# Altium project Flex_PCB.PrjPcb
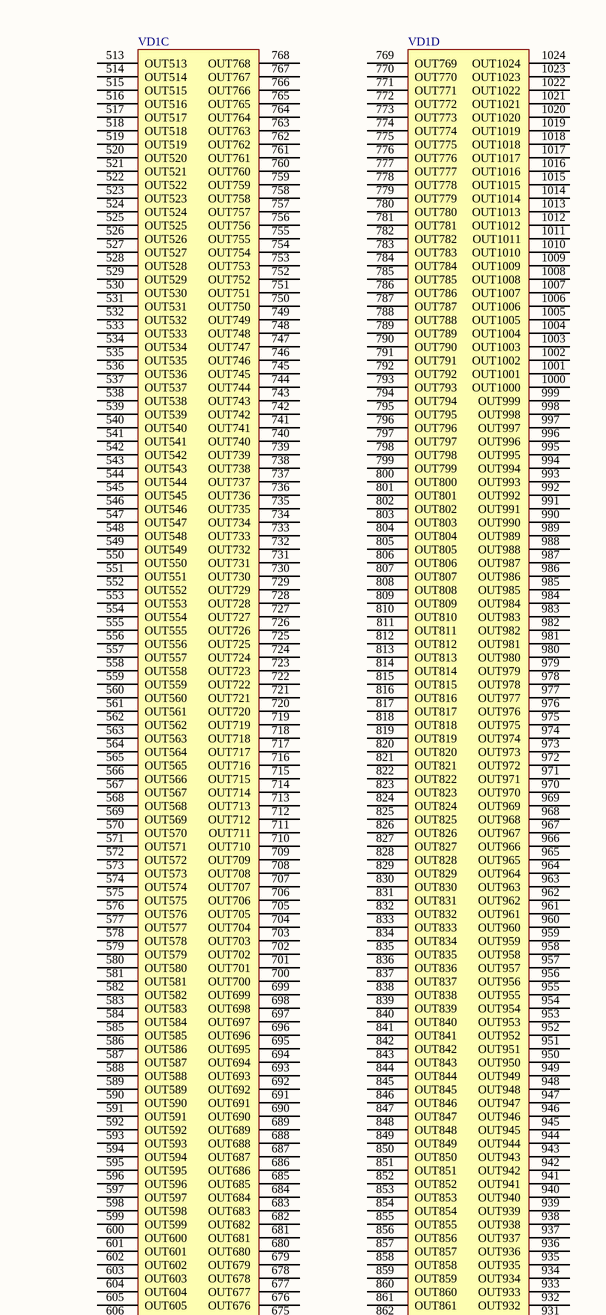
[diagram p0: Sheet1.SchDoc, top right]
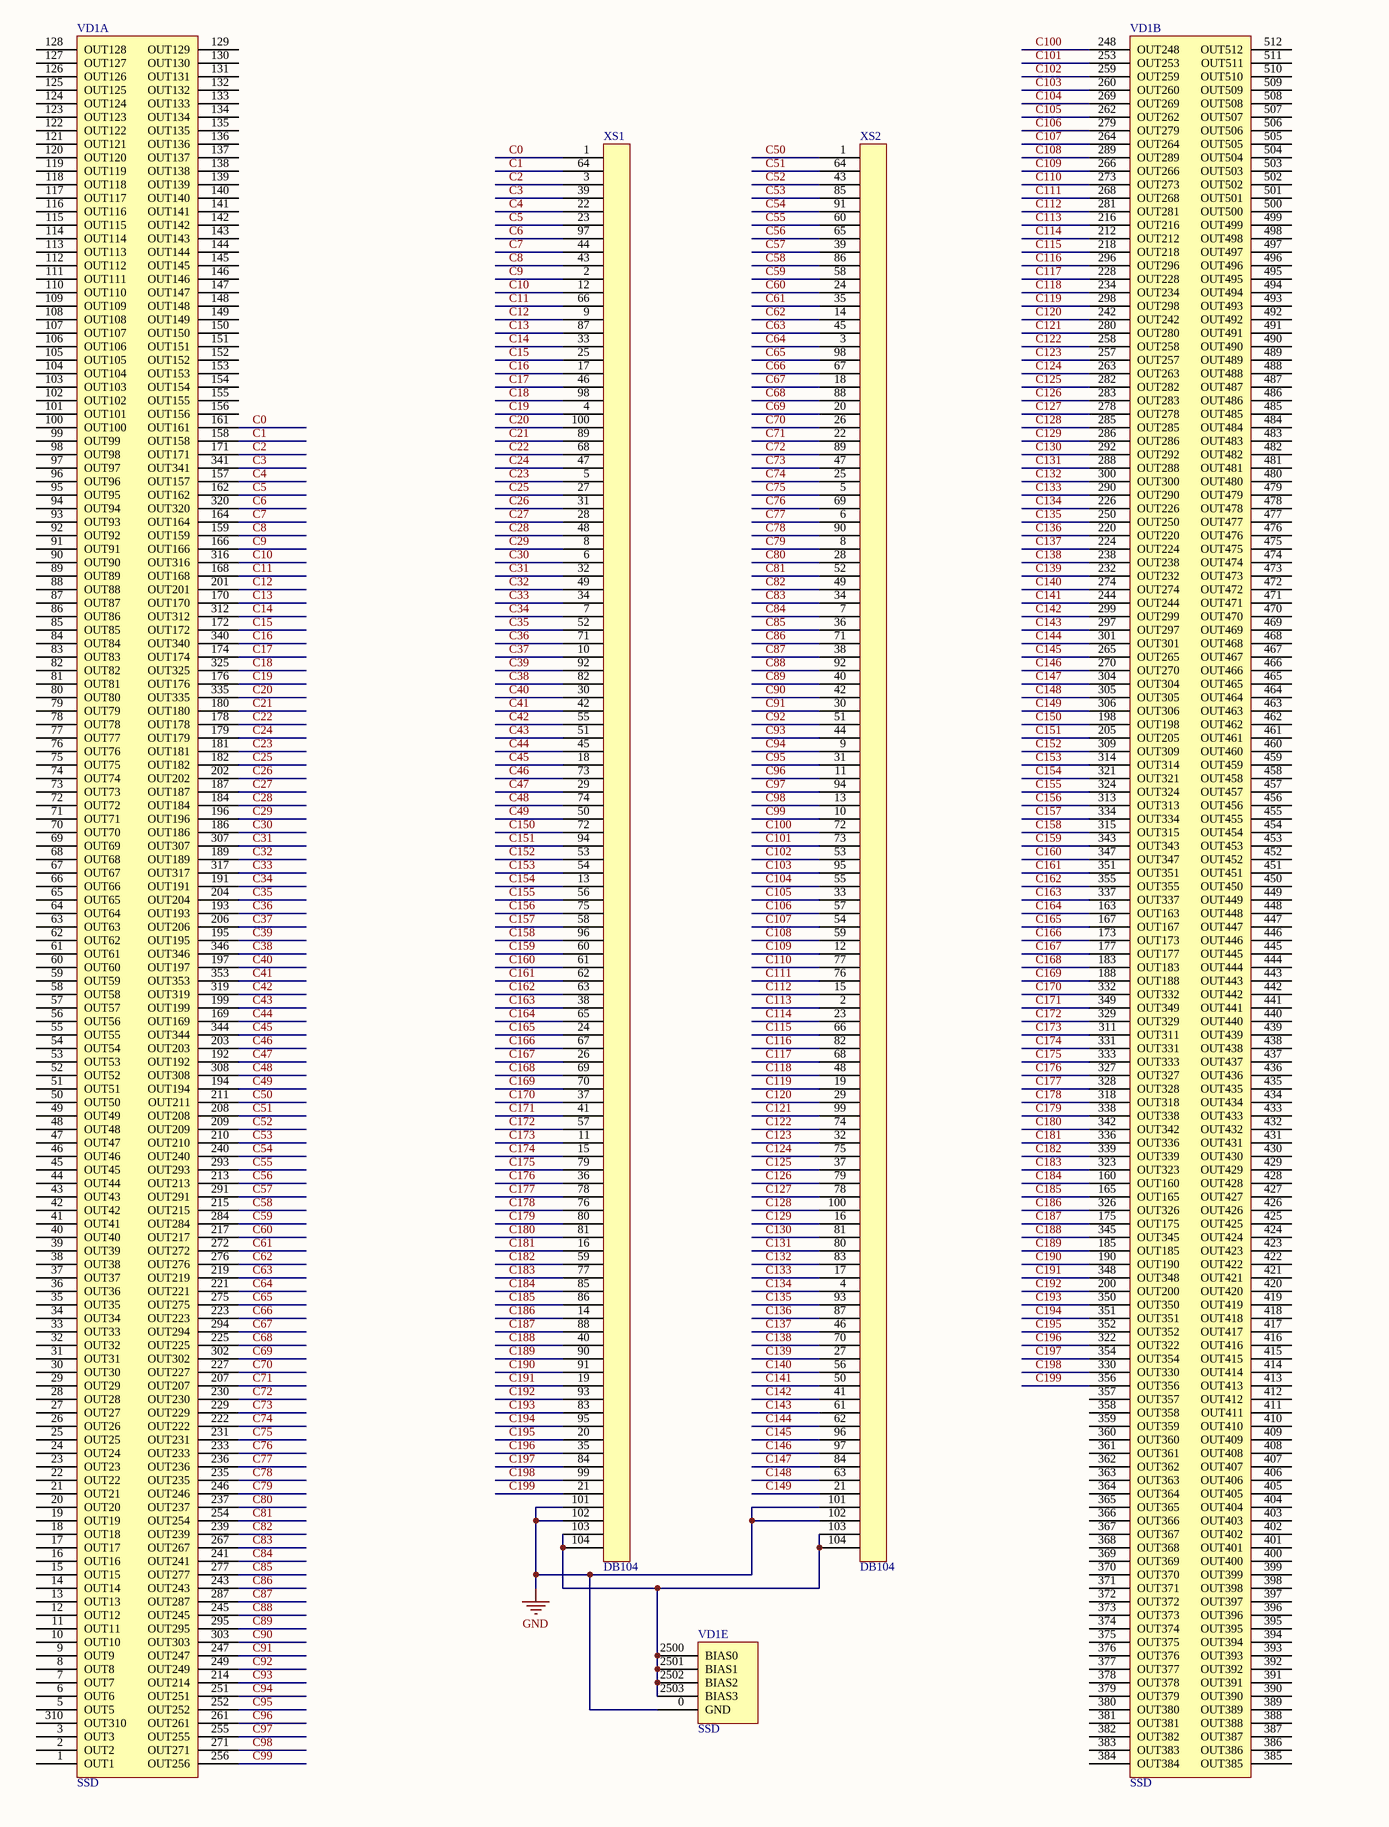
[diagram p1: Sheet1.SchDoc, bottom left]
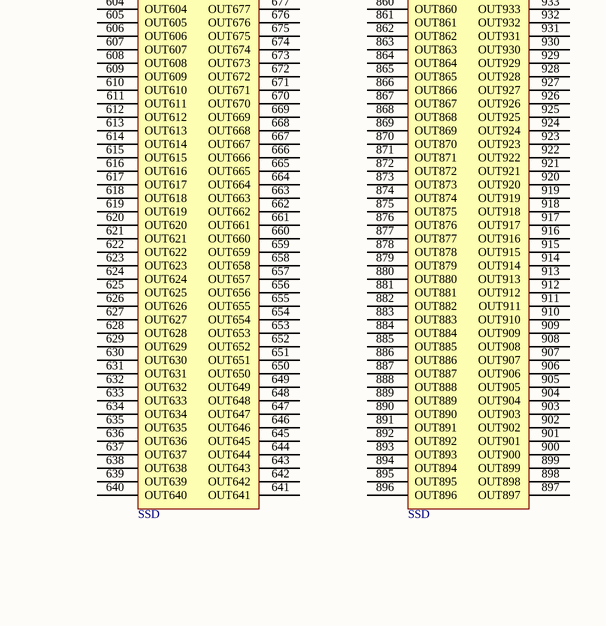
[diagram p2: Sheet1.SchDoc, bottom right]
1 sheet, 3 parts. Net scope: global (net labels, ports and power ports of the same name join across sheets).
Board file: PCB.PcbDoc

## Sheet Sheet1.SchDoc
size A1

### Parts
VD1  SSD  [QFN20P11000X11000X80-2048N]  (parts A,B,C,D,E of 5)
XS1  DB104  [DB104]
XS2  DB104  [DB104]

### Nets
GND: VD1.0(GND) XS1.101 XS1.102 XS2.101 XS2.102
C0: VD1.161(OUT161) XS1.1
C1: VD1.158(OUT158) XS1.64
C2: VD1.171(OUT171) XS1.3
C3: VD1.341(OUT341) XS1.39
C4: VD1.157(OUT157) XS1.22
C5: VD1.162(OUT162) XS1.23
C6: VD1.320(OUT320) XS1.97
C7: VD1.164(OUT164) XS1.44
C8: VD1.159(OUT159) XS1.43
C9: VD1.166(OUT166) XS1.2
C10: VD1.316(OUT316) XS1.12
C11: VD1.168(OUT168) XS1.66
C12: VD1.201(OUT201) XS1.9
C13: VD1.170(OUT170) XS1.87
C14: VD1.312(OUT312) XS1.33
C15: VD1.172(OUT172) XS1.25
C16: VD1.340(OUT340) XS1.17
C17: VD1.174(OUT174) XS1.46
C18: VD1.325(OUT325) XS1.98
C19: VD1.176(OUT176) XS1.4
C20: VD1.335(OUT335) XS1.100
C21: VD1.180(OUT180) XS1.89
C22: VD1.178(OUT178) XS1.68
C23: VD1.181(OUT181) XS1.5
C24: VD1.179(OUT179) XS1.47
C25: VD1.182(OUT182) XS1.27
C26: VD1.202(OUT202) XS1.31
C27: VD1.187(OUT187) XS1.28
C28: VD1.184(OUT184) XS1.48
C29: VD1.196(OUT196) XS1.8
C30: VD1.186(OUT186) XS1.6
C31: VD1.307(OUT307) XS1.32
C32: VD1.189(OUT189) XS1.49
C33: VD1.317(OUT317) XS1.34
C34: VD1.191(OUT191) XS1.7
C35: VD1.204(OUT204) XS1.52
C36: VD1.193(OUT193) XS1.71
C37: VD1.206(OUT206) XS1.10
C38: VD1.346(OUT346) XS1.82
C39: VD1.195(OUT195) XS1.92
C40: VD1.197(OUT197) XS1.30
C41: VD1.353(OUT353) XS1.42
C42: VD1.319(OUT319) XS1.55
C43: VD1.199(OUT199) XS1.51
C44: VD1.169(OUT169) XS1.45
C45: VD1.344(OUT344) XS1.18
C46: VD1.203(OUT203) XS1.73
C47: VD1.192(OUT192) XS1.29
C48: VD1.308(OUT308) XS1.74
C49: VD1.194(OUT194) XS1.50
C50: VD1.211(OUT211) XS2.1
C51: VD1.208(OUT208) XS2.64
C52: VD1.209(OUT209) XS2.43
C53: VD1.210(OUT210) XS2.85
C54: VD1.240(OUT240) XS2.91
C55: VD1.293(OUT293) XS2.60
C56: VD1.213(OUT213) XS2.65
C57: VD1.291(OUT291) XS2.39
C58: VD1.215(OUT215) XS2.86
C59: VD1.284(OUT284) XS2.58
C60: VD1.217(OUT217) XS2.24
C61: VD1.272(OUT272) XS2.35
C62: VD1.276(OUT276) XS2.14
C63: VD1.219(OUT219) XS2.45
C64: VD1.221(OUT221) XS2.3
C65: VD1.275(OUT275) XS2.98
C66: VD1.223(OUT223) XS2.67
C67: VD1.294(OUT294) XS2.18
C68: VD1.225(OUT225) XS2.88
C69: VD1.302(OUT302) XS2.20
C70: VD1.227(OUT227) XS2.26
C71: VD1.207(OUT207) XS2.22
C72: VD1.230(OUT230) XS2.89
C73: VD1.229(OUT229) XS2.47
C74: VD1.222(OUT222) XS2.25
C75: VD1.231(OUT231) XS2.5
C76: VD1.233(OUT233) XS2.69
C77: VD1.236(OUT236) XS2.6
C78: VD1.235(OUT235) XS2.90
C79: VD1.246(OUT246) XS2.8
C80: VD1.237(OUT237) XS2.28
C81: VD1.254(OUT254) XS2.52
C82: VD1.239(OUT239) XS2.49
C83: VD1.267(OUT267) XS2.34
C84: VD1.241(OUT241) XS2.7
C85: VD1.277(OUT277) XS2.36
C86: VD1.243(OUT243) XS2.71
C87: VD1.287(OUT287) XS2.38
C88: VD1.245(OUT245) XS2.92
C89: VD1.295(OUT295) XS2.40
C90: VD1.303(OUT303) XS2.42
C91: VD1.247(OUT247) XS2.30
C92: VD1.249(OUT249) XS2.51
C93: VD1.214(OUT214) XS2.44
C94: VD1.251(OUT251) XS2.9
C95: VD1.252(OUT252) XS2.31
C96: VD1.261(OUT261) XS2.11
C97: VD1.255(OUT255) XS2.94
C98: VD1.271(OUT271) XS2.13
C99: VD1.256(OUT256) XS2.10
C100: VD1.248(OUT248) XS2.72
C101: VD1.253(OUT253) XS2.73
C102: VD1.259(OUT259) XS2.53
C103: VD1.260(OUT260) XS2.95
C104: VD1.269(OUT269) XS2.55
C105: VD1.262(OUT262) XS2.33
C106: VD1.279(OUT279) XS2.57
C107: VD1.264(OUT264) XS2.54
C108: VD1.289(OUT289) XS2.59
C109: VD1.266(OUT266) XS2.12
C110: VD1.273(OUT273) XS2.77
C111: VD1.268(OUT268) XS2.76
C112: VD1.281(OUT281) XS2.15
C113: VD1.216(OUT216) XS2.2
C114: VD1.212(OUT212) XS2.23
C115: VD1.218(OUT218) XS2.66
C116: VD1.296(OUT296) XS2.82
C117: VD1.228(OUT228) XS2.68
C118: VD1.234(OUT234) XS2.48
C119: VD1.298(OUT298) XS2.19
C120: VD1.242(OUT242) XS2.29
C121: VD1.280(OUT280) XS2.99
C122: VD1.258(OUT258) XS2.74
C123: VD1.257(OUT257) XS2.32
C124: VD1.263(OUT263) XS2.75
C125: VD1.282(OUT282) XS2.37
C126: VD1.283(OUT283) XS2.79
C127: VD1.278(OUT278) XS2.78
C128: VD1.285(OUT285) XS2.100
C129: VD1.286(OUT286) XS2.16
C130: VD1.292(OUT292) XS2.81
C131: VD1.288(OUT288) XS2.80
C132: VD1.300(OUT300) XS2.83
C133: VD1.290(OUT290) XS2.17
C134: VD1.226(OUT226) XS2.4
C135: VD1.250(OUT250) XS2.93
C136: VD1.220(OUT220) XS2.87
C137: VD1.224(OUT224) XS2.46
C138: VD1.238(OUT238) XS2.70
C139: VD1.232(OUT232) XS2.27
C140: VD1.274(OUT274) XS2.56
C141: VD1.244(OUT244) XS2.50
C142: VD1.299(OUT299) XS2.41
C143: VD1.297(OUT297) XS2.61
C144: VD1.301(OUT301) XS2.62
C145: VD1.265(OUT265) XS2.96
C146: VD1.270(OUT270) XS2.97
C147: VD1.304(OUT304) XS2.84
C148: VD1.305(OUT305) XS2.63
C149: VD1.306(OUT306) XS2.21
C150: VD1.198(OUT198) XS1.72
C151: VD1.205(OUT205) XS1.94
C152: VD1.309(OUT309) XS1.53
C153: VD1.314(OUT314) XS1.54
C154: VD1.321(OUT321) XS1.13
C155: VD1.324(OUT324) XS1.56
C156: VD1.313(OUT313) XS1.75
C157: VD1.334(OUT334) XS1.58
C158: VD1.315(OUT315) XS1.96
C159: VD1.343(OUT343) XS1.60
C160: VD1.347(OUT347) XS1.61
C161: VD1.351(OUT351) XS1.62
C162: VD1.355(OUT355) XS1.63
C163: VD1.337(OUT337) XS1.38
C164: VD1.163(OUT163) XS1.65
C165: VD1.167(OUT167) XS1.24
C166: VD1.173(OUT173) XS1.67
C167: VD1.177(OUT177) XS1.26
C168: VD1.183(OUT183) XS1.69
C169: VD1.188(OUT188) XS1.70
C170: VD1.332(OUT332) XS1.37
C171: VD1.349(OUT349) XS1.41
C172: VD1.329(OUT329) XS1.57
C173: VD1.311(OUT311) XS1.11
C174: VD1.331(OUT331) XS1.15
C175: VD1.333(OUT333) XS1.79
C176: VD1.327(OUT327) XS1.36
C177: VD1.328(OUT328) XS1.78
C178: VD1.318(OUT318) XS1.76
C179: VD1.338(OUT338) XS1.80
C180: VD1.342(OUT342) XS1.81
C181: VD1.336(OUT336) XS1.16
C182: VD1.339(OUT339) XS1.59
C183: VD1.323(OUT323) XS1.77
C184: VD1.160(OUT160) XS1.85
C185: VD1.165(OUT165) XS1.86
C186: VD1.326(OUT326) XS1.14
C187: VD1.175(OUT175) XS1.88
C188: VD1.345(OUT345) XS1.40
C189: VD1.185(OUT185) XS1.90
C190: VD1.190(OUT190) XS1.91
C191: VD1.348(OUT348) XS1.19
C192: VD1.200(OUT200) XS1.93
C193: VD1.350(OUT350) XS1.83
C194: VD1.351(OUT351) XS1.95
C195: VD1.352(OUT352) XS1.20
C196: VD1.322(OUT322) XS1.35
C197: VD1.354(OUT354) XS1.84
C198: VD1.330(OUT330) XS1.99
C199: VD1.356(OUT356) XS1.21
NetVD1_2500: VD1.2500(BIAS0) VD1.2501(BIAS1) VD1.2502(BIAS2) VD1.2503(BIAS3) XS1.103 XS1.104 XS2.103 XS2.104

Not connected (* = marked no-connect by the designer): VD1 1(OUT1) 2(OUT2) 3(OUT3) 5(OUT5) 6(OUT6) 7(OUT7) 8(OUT8) 9(OUT9) 10(OUT10) 11(OUT11) 12(OUT12) 13(OUT13) 14(OUT14) 15(OUT15) 16(OUT16) 17(OUT17) 18(OUT18) 19(OUT19) 20(OUT20) 21(OUT21) 22(OUT22) 23(OUT23) 24(OUT24) 25(OUT25) 26(OUT26) 27(OUT27) 28(OUT28) 29(OUT29) 30(OUT30) 31(OUT31) 32(OUT32) 33(OUT33) 34(OUT34) 35(OUT35) 36(OUT36) 37(OUT37) 38(OUT38) 39(OUT39) 40(OUT40) 41(OUT41) 42(OUT42) 43(OUT43) 44(OUT44) 45(OUT45) 46(OUT46) 47(OUT47) 48(OUT48) 49(OUT49) 50(OUT50) 51(OUT51) 52(OUT52) 53(OUT53) 54(OUT54) 55(OUT55) 56(OUT56) 57(OUT57) 58(OUT58) 59(OUT59) 60(OUT60) 61(OUT61) 62(OUT62) 63(OUT63) 64(OUT64) 65(OUT65) 66(OUT66) 67(OUT67) 68(OUT68) 69(OUT69) 70(OUT70) 71(OUT71) 72(OUT72) 73(OUT73) 74(OUT74) 75(OUT75) 76(OUT76) 77(OUT77) 78(OUT78) 79(OUT79) 80(OUT80) 81(OUT81) 82(OUT82) 83(OUT83) 84(OUT84) 85(OUT85) 86(OUT86) 87(OUT87) 88(OUT88) 89(OUT89) 90(OUT90) 91(OUT91) 92(OUT92) 93(OUT93) 94(OUT94) 95(OUT95) 96(OUT96) 97(OUT97) 98(OUT98) 99(OUT99) 100(OUT100) 101(OUT101) 102(OUT102) 103(OUT103) 104(OUT104) 105(OUT105) 106(OUT106) 107(OUT107) 108(OUT108) 109(OUT109) 110(OUT110) 111(OUT111) 112(OUT112) 113(OUT113) 114(OUT114) 115(OUT115) 116(OUT116) 117(OUT117) 118(OUT118) 119(OUT119) 120(OUT120) 121(OUT121) 122(OUT122) 123(OUT123) 124(OUT124) 125(OUT125) 126(OUT126) 127(OUT127) 128(OUT128) 129(OUT129) 130(OUT130) 131(OUT131) 132(OUT132) 133(OUT133) 134(OUT134) 135(OUT135) 136(OUT136) 137(OUT137) 138(OUT138) 139(OUT139) 140(OUT140) 141(OUT141) 142(OUT142) 143(OUT143) 144(OUT144) 145(OUT145) 146(OUT146) 147(OUT147) 148(OUT148) 149(OUT149) 150(OUT150) 151(OUT151) 152(OUT152) 153(OUT153) 154(OUT154) 155(OUT155) 156(OUT156) 310(OUT310) 357(OUT357) 358(OUT358) 359(OUT359) 360(OUT360) 361(OUT361) 362(OUT362) 363(OUT363) 364(OUT364) 365(OUT365) 366(OUT366) 367(OUT367) 368(OUT368) 369(OUT369) 370(OUT370) 371(OUT371) 372(OUT372) 373(OUT373) 374(OUT374) 375(OUT375) 376(OUT376) 377(OUT377) 378(OUT378) 379(OUT379) 380(OUT380) 381(OUT381) 382(OUT382) 383(OUT383) 384(OUT384) 385(OUT385) 386(OUT386) 387(OUT387) 388(OUT388) 389(OUT389) 390(OUT390) 391(OUT391) 392(OUT392) 393(OUT393) 394(OUT394) 395(OUT395) 396(OUT396) 397(OUT397) 398(OUT398) 399(OUT399) 400(OUT400) 401(OUT401) 402(OUT402) 403(OUT403) 404(OUT404) 405(OUT405) 406(OUT406) 407(OUT407) 408(OUT408) 409(OUT409) 410(OUT410) 411(OUT411) 412(OUT412) 413(OUT413) 414(OUT414) 415(OUT415) 416(OUT416) 417(OUT417) 418(OUT418) 419(OUT419) 420(OUT420) 421(OUT421) 422(OUT422) 423(OUT423) 424(OUT424) 425(OUT425) 426(OUT426) 427(OUT427) 428(OUT428) 429(OUT429) 430(OUT430) 431(OUT431) 432(OUT432) 433(OUT433) 434(OUT434) 435(OUT435) 436(OUT436) 437(OUT437) 438(OUT438) 439(OUT439) 440(OUT440) 441(OUT441) 442(OUT442) 443(OUT443) 444(OUT444) 445(OUT445) 446(OUT446) 447(OUT447) 448(OUT448) 449(OUT449) 450(OUT450) 451(OUT451) 452(OUT452) 453(OUT453) 454(OUT454) 455(OUT455) 456(OUT456) 457(OUT457) 458(OUT458) 459(OUT459) 460(OUT460) 461(OUT461) 462(OUT462) 463(OUT463) 464(OUT464) 465(OUT465) 466(OUT466) 467(OUT467) 468(OUT468) 469(OUT469) 470(OUT470) 471(OUT471) 472(OUT472) 473(OUT473) 474(OUT474) 475(OUT475) 476(OUT476) 477(OUT477) 478(OUT478) 479(OUT479) 480(OUT480) 481(OUT481) 482(OUT482) 483(OUT483) 484(OUT484) 485(OUT485) 486(OUT486) 487(OUT487) 488(OUT488) 489(OUT489) 490(OUT490) 491(OUT491) 492(OUT492) 493(OUT493) 494(OUT494) 495(OUT495) 496(OUT496) 497(OUT497) 498(OUT498) 499(OUT499) 500(OUT500) 501(OUT501) 502(OUT502) 503(OUT503) 504(OUT504) 505(OUT505) 506(OUT506) 507(OUT507) 508(OUT508) 509(OUT509) 510(OUT510) 511(OUT511) 512(OUT512) 513(OUT513) 514(OUT514) 515(OUT515) 516(OUT516) 517(OUT517) 518(OUT518) 519(OUT519) 520(OUT520) 521(OUT521) 522(OUT522) 523(OUT523) 524(OUT524) 525(OUT525) 526(OUT526) 527(OUT527) 528(OUT528) 529(OUT529) 530(OUT530) 531(OUT531) 532(OUT532) 533(OUT533) 534(OUT534) 535(OUT535) 536(OUT536) 537(OUT537) 538(OUT538) 539(OUT539) 540(OUT540) 541(OUT541) 542(OUT542) 543(OUT543) 544(OUT544) 545(OUT545) 546(OUT546) 547(OUT547) 548(OUT548) 549(OUT549) 550(OUT550) 551(OUT551) 552(OUT552) 553(OUT553) 554(OUT554) 555(OUT555) 556(OUT556) 557(OUT557) 558(OUT558) 559(OUT559) 560(OUT560) 561(OUT561) 562(OUT562) 563(OUT563) 564(OUT564) 565(OUT565) 566(OUT566) 567(OUT567) 568(OUT568) 569(OUT569) 570(OUT570) 571(OUT571) 572(OUT572) 573(OUT573) 574(OUT574) 575(OUT575) 576(OUT576) 577(OUT577) 578(OUT578) 579(OUT579) 580(OUT580) 581(OUT581) 582(OUT582) 583(OUT583) 584(OUT584) 585(OUT585) 586(OUT586) 587(OUT587) 588(OUT588) 589(OUT589) 590(OUT590) 591(OUT591) 592(OUT592) 593(OUT593) 594(OUT594) 595(OUT595) 596(OUT596) 597(OUT597) 598(OUT598) 599(OUT599) 600(OUT600) 601(OUT601) 602(OUT602) 603(OUT603) 604(OUT604) 605(OUT605) 606(OUT606) 607(OUT607) 608(OUT608) 609(OUT609) 610(OUT610) 611(OUT611) 612(OUT612) 613(OUT613) 614(OUT614) 615(OUT615) 616(OUT616) 617(OUT617) 618(OUT618) 619(OUT619) 620(OUT620) 621(OUT621) 622(OUT622) 623(OUT623) 624(OUT624) 625(OUT625) 626(OUT626) 627(OUT627) 628(OUT628) 629(OUT629) 630(OUT630) 631(OUT631) 632(OUT632) 633(OUT633) 634(OUT634) 635(OUT635) 636(OUT636) 637(OUT637) 638(OUT638) 639(OUT639) 640(OUT640) 641(OUT641) 642(OUT642) 643(OUT643) 644(OUT644) 645(OUT645) 646(OUT646) 647(OUT647) 648(OUT648) 649(OUT649) 650(OUT650) 651(OUT651) 652(OUT652) 653(OUT653) 654(OUT654) 655(OUT655) 656(OUT656) 657(OUT657) 658(OUT658) 659(OUT659) 660(OUT660) 661(OUT661) 662(OUT662) 663(OUT663) 664(OUT664) 665(OUT665) 666(OUT666) 667(OUT667) 668(OUT668) 669(OUT669) 670(OUT670) 671(OUT671) 672(OUT672) 673(OUT673) 674(OUT674) 675(OUT675) 676(OUT676) 677(OUT677) 678(OUT678) 679(OUT679) 680(OUT680) 681(OUT681) 682(OUT682) 683(OUT683) 684(OUT684) 685(OUT685) 686(OUT686) 687(OUT687) 688(OUT688) 689(OUT689) 690(OUT690) 691(OUT691) 692(OUT692) 693(OUT693) 694(OUT694) 695(OUT695) 696(OUT696) 697(OUT697) 698(OUT698) 699(OUT699) 700(OUT700) 701(OUT701) 702(OUT702) 703(OUT703) 704(OUT704) 705(OUT705) 706(OUT706) 707(OUT707) 708(OUT708) 709(OUT709) 710(OUT710) 711(OUT711) 712(OUT712) 713(OUT713) 714(OUT714) 715(OUT715) 716(OUT716) 717(OUT717) 718(OUT718) 719(OUT719) 720(OUT720) 721(OUT721) 722(OUT722) 723(OUT723) 724(OUT724) 725(OUT725) 726(OUT726) 727(OUT727) 728(OUT728) 729(OUT729) 730(OUT730) 731(OUT731) 732(OUT732) 733(OUT733) 734(OUT734) 735(OUT735) 736(OUT736) 737(OUT737) 738(OUT738) 739(OUT739) 740(OUT740) 741(OUT741) 742(OUT742) 743(OUT743) 744(OUT744) 745(OUT745) 746(OUT746) 747(OUT747) 748(OUT748) 749(OUT749) 750(OUT750) 751(OUT751) 752(OUT752) 753(OUT753) 754(OUT754) 755(OUT755) 756(OUT756) 757(OUT757) 758(OUT758) 759(OUT759) 760(OUT760) 761(OUT761) 762(OUT762) 763(OUT763) 764(OUT764) 765(OUT765) 766(OUT766) 767(OUT767) 768(OUT768) 769(OUT769) 770(OUT770) 771(OUT771) 772(OUT772) 773(OUT773) 774(OUT774) 775(OUT775) 776(OUT776) 777(OUT777) 778(OUT778) 779(OUT779) 780(OUT780) 781(OUT781) 782(OUT782) 783(OUT783) 784(OUT784) 785(OUT785) 786(OUT786) 787(OUT787) 788(OUT788) 789(OUT789) 790(OUT790) 791(OUT791) 792(OUT792) 793(OUT793) 794(OUT794) 795(OUT795) 796(OUT796) 797(OUT797) 798(OUT798) 799(OUT799) 800(OUT800) 801(OUT801) 802(OUT802) 803(OUT803) 804(OUT804) 805(OUT805) 806(OUT806) 807(OUT807) 808(OUT808) 809(OUT809) 810(OUT810) 811(OUT811) 812(OUT812) 813(OUT813) 814(OUT814) 815(OUT815) 816(OUT816) 817(OUT817) 818(OUT818) 819(OUT819) 820(OUT820) 821(OUT821) 822(OUT822) 823(OUT823) 824(OUT824) 825(OUT825) 826(OUT826) 827(OUT827) 828(OUT828) 829(OUT829) 830(OUT830) 831(OUT831) 832(OUT832) 833(OUT833) 834(OUT834) 835(OUT835) 836(OUT836) 837(OUT837) 838(OUT838) 839(OUT839) 840(OUT840) 841(OUT841) 842(OUT842) 843(OUT843) 844(OUT844) 845(OUT845) 846(OUT846) 847(OUT847) 848(OUT848) 849(OUT849) 850(OUT850) 851(OUT851) 852(OUT852) 853(OUT853) 854(OUT854) 855(OUT855) 856(OUT856) 857(OUT857) 858(OUT858) 859(OUT859) 860(OUT860) 861(OUT861) 862(OUT862) 863(OUT863) 864(OUT864) 865(OUT865) 866(OUT866) 867(OUT867) 868(OUT868) 869(OUT869) 870(OUT870) 871(OUT871) 872(OUT872) 873(OUT873) 874(OUT874) 875(OUT875) 876(OUT876) 877(OUT877) 878(OUT878) 879(OUT879) 880(OUT880) 881(OUT881) 882(OUT882) 883(OUT883) 884(OUT884) 885(OUT885) 886(OUT886) 887(OUT887) 888(OUT888) 889(OUT889) 890(OUT890) 891(OUT891) 892(OUT892) 893(OUT893) 894(OUT894) 895(OUT895) 896(OUT896) 897(OUT897) 898(OUT898) 899(OUT899) 900(OUT900) 901(OUT901) 902(OUT902) 903(OUT903) 904(OUT904) 905(OUT905) 906(OUT906) 907(OUT907) 908(OUT908) 909(OUT909) 910(OUT910) 911(OUT911) 912(OUT912) 913(OUT913) 914(OUT914) 915(OUT915) 916(OUT916) 917(OUT917) 918(OUT918) 919(OUT919) 920(OUT920) 921(OUT921) 922(OUT922) 923(OUT923) 924(OUT924) 925(OUT925) 926(OUT926) 927(OUT927) 928(OUT928) 929(OUT929) 930(OUT930) 931(OUT931) 932(OUT932) 933(OUT933) 934(OUT934) 935(OUT935) 936(OUT936) 937(OUT937) 938(OUT938) 939(OUT939) 940(OUT940) 941(OUT941) 942(OUT942) 943(OUT943) 944(OUT944) 945(OUT945) 946(OUT946) 947(OUT947) 948(OUT948) 949(OUT949) 950(OUT950) 951(OUT951) 952(OUT952) 953(OUT953) 954(OUT954) 955(OUT955) 956(OUT956) 957(OUT957) 958(OUT958) 959(OUT959) 960(OUT960) 961(OUT961) 962(OUT962) 963(OUT963) 964(OUT964) 965(OUT965) 966(OUT966) 967(OUT967) 968(OUT968) 969(OUT969) 970(OUT970) 971(OUT971) 972(OUT972) 973(OUT973) 974(OUT974) 975(OUT975) 976(OUT976) 977(OUT977) 978(OUT978) 979(OUT979) 980(OUT980) 981(OUT981) 982(OUT982) 983(OUT983) 984(OUT984) 985(OUT985) 986(OUT986) 987(OUT987) 988(OUT988) 989(OUT989) 990(OUT990) 991(OUT991) 992(OUT992) 993(OUT993) 994(OUT994) 995(OUT995) 996(OUT996) 997(OUT997) 998(OUT998) 999(OUT999) 1000(OUT1000) 1001(OUT1001) 1002(OUT1002) 1003(OUT1003) 1004(OUT1004) 1005(OUT1005) 1006(OUT1006) 1007(OUT1007) 1008(OUT1008) 1009(OUT1009) 1010(OUT1010) 1011(OUT1011) 1012(OUT1012) 1013(OUT1013) 1014(OUT1014) 1015(OUT1015) 1016(OUT1016) 1017(OUT1017) 1018(OUT1018) 1019(OUT1019) 1020(OUT1020) 1021(OUT1021) 1022(OUT1022) 1023(OUT1023) 1024(OUT1024)